# EAGLE design homecomputer-6502 (EAGLE 6.5.0)
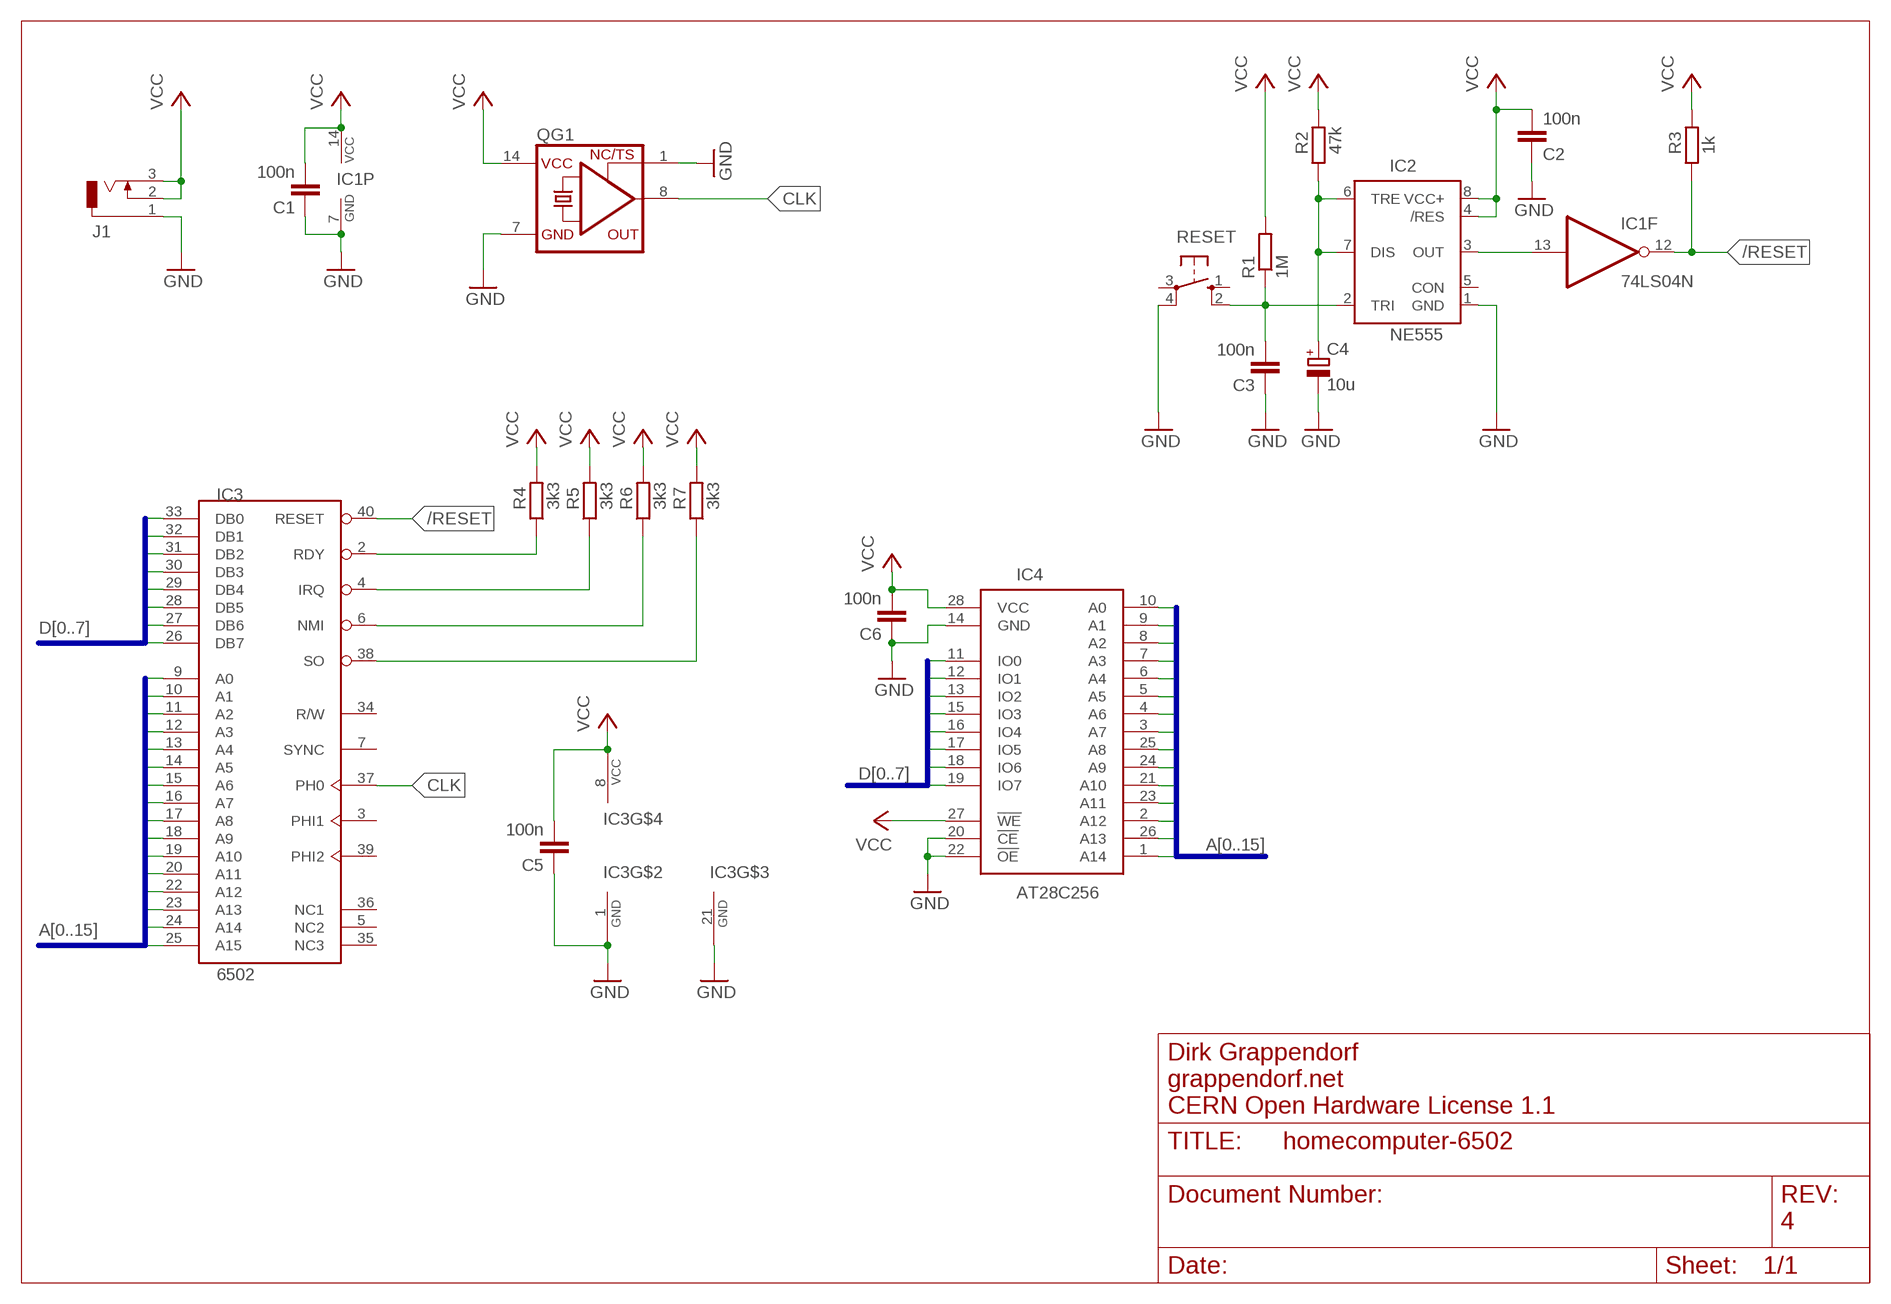
[diagram p0: schematic, sheet 1]

## Parts
C1  100n  C-EU025-024X044  [C025-024X044]
C2  100n  C-EU025-024X044  [C025-024X044]
C3  100n  C-EU025-024X044  [C025-024X044]
C4  10u  CPOL-EUE2,5-6E  [E2,5-6E]
C5  100n  C-EU025-024X044  [C025-024X044]
C6  100n  C-EU025-024X044  [C025-024X044]
IC1  74LS04N  [DIL14]
IC2  NE555  [DIL-08]
IC3  6502  [DIP40]
IC4  AT28C256  [DIL28-6]
J1  DCJ0303  [DCJ0303]
QG1  XO-14  [DIL14S]
R1  1M  R-EU_0204/5  [0204/5]
R2  47k  R-EU_0204/5  [0204/5]
R3  1k  R-EU_0204/5  [0204/5]
R4  3k3  R-EU_0204/5  [0204/5]
R5  3k3  R-EU_0204/5  [0204/5]
R6  3k3  R-EU_0204/5  [0204/5]
R7  3k3  R-EU_0204/5  [0204/5]
RESET  10-XX  [B3F-10XX]

## Nets
/RESET: IC1.12(F:O) IC3.40(RESET) R3.1
A0: IC3.9(A0) IC4.10(A0)
A1: IC3.10(A1) IC4.9(A1)
A2: IC3.11(A2) IC4.8(A2)
A3: IC3.12(A3) IC4.7(A3)
A4: IC3.13(A4) IC4.6(A4)
A5: IC3.14(A5) IC4.5(A5)
A6: IC3.15(A6) IC4.4(A6)
A7: IC3.16(A7) IC4.3(A7)
A8: IC3.17(A8) IC4.25(A8)
A9: IC3.18(A9) IC4.24(A9)
A10: IC3.19(A10) IC4.21(A10)
A11: IC3.20(A11) IC4.23(A11)
A12: IC3.22(A12) IC4.2(A12)
A13: IC3.23(A13) IC4.26(A13)
A14: IC3.24(A14) IC4.1(A14)
A15: IC3.25(A15)
CLK: IC3.37(PH0) QG1.8(OUT)
D0: IC3.33(DB0) IC4.11(IO0)
D1: IC3.32(DB1) IC4.12(IO1)
D2: IC3.31(DB2) IC4.13(IO2)
D3: IC3.30(DB3) IC4.15(IO3)
D4: IC3.29(DB4) IC4.16(IO4)
D5: IC3.28(DB5) IC4.17(IO5)
D6: IC3.27(DB6) IC4.18(IO6)
D7: IC3.26(DB7) IC4.19(IO7)
GND: C1.1 C2.1 C3.1 C4.- C5.1 C6.1 IC1.7(P:GND) IC2.1(GND) IC3.1(GND) IC3.21(GND) IC4.14(GND) IC4.20(!CE) IC4.22(!OE) J1.1 QG1.1(TS) QG1.7(GND) RESET.4(P1)
N$3: IC3.2(RDY) R4.1
N$4: C4.+ IC2.6(TRE) IC2.7(DIS) R2.1
N$5: IC1.13(F:I) IC2.3(OUT)
N$6: C3.2 IC2.2(TRI) R1.1 RESET.2(S1)
N$9: IC3.4(IRQ) R5.1
N$10: IC3.6(NMI) R6.1
N$11: IC3.38(SO) R7.1
VCC: C1.2 C2.2 C5.2 C6.2 IC1.14(P:VCC) IC2.4(/RES) IC2.8(VCC+) IC3.8(VCC) IC4.27(!WE) IC4.28(VCC) J1.2 J1.3 QG1.14(VCC) R1.2 R2.2 R3.2 R4.2 R5.2 R6.2 R7.2
Unconnected: IC1.1(A:I) IC1.2(A:O) IC1.3(B:I) IC1.4(B:O) IC1.5(C:I) IC1.6(C:O) IC1.8(D:O) IC1.9(D:I) IC1.10(E:O) IC1.11(E:I) IC2.5(CON) IC3.3(PHI1) IC3.5(NC2) IC3.7(SYNC) IC3.34(R/W) IC3.35(NC3) IC3.36(NC1) IC3.39(PHI2) RESET.1(S) RESET.3(P)

## Buses
A[0..15]
D[0..7]

## Notes on the sheet
- Dirk Grappendorf
- grappendorf.net
- CERN Open Hardware License 1.1
- 4

## Library data of the parts
C1-C3 C5 C6 = rcl:C-EU: CAPACITOR, European symbol
C4 = rcl:CPOL-EU: POLARIZED CAPACITOR, European symbol
IC1 = 74xx-eu:74*04: Hex INVERTER
IC2 = st-microelectronics:NE555: General purpose bipolar Timer; MF: Arrow Electronics; MPN: NE555N; OC_FARNELL: 1467742; OC_NEWARK: 89K1486
IC3 = 6502:6502: 6502 processor
IC4 = atmel-28c:AT28C256: EEPROM 32Kx8 256k bit The AT28C256 is a high-performance Electrically Erasable and Programmable Read Only Memory. Its 256K of memory is organized as 32,768 words by 8 bits.
J1 = con-jack:DCJ0303: DC POWER JACK Source: DCJ0303.pdf; OC_FARNELL: unknown; OC_NEWARK: unknown
QG1 = crystal2:XO-: CRYSTAL
R1-R7 = rcl:R-EU_: RESISTOR, European symbol
RESET = switch-omron:10-XX: OMRON SWITCH; MPN: B3F-1000; OC_FARNELL: 176432; OC_NEWARK: 36M3542

## Board
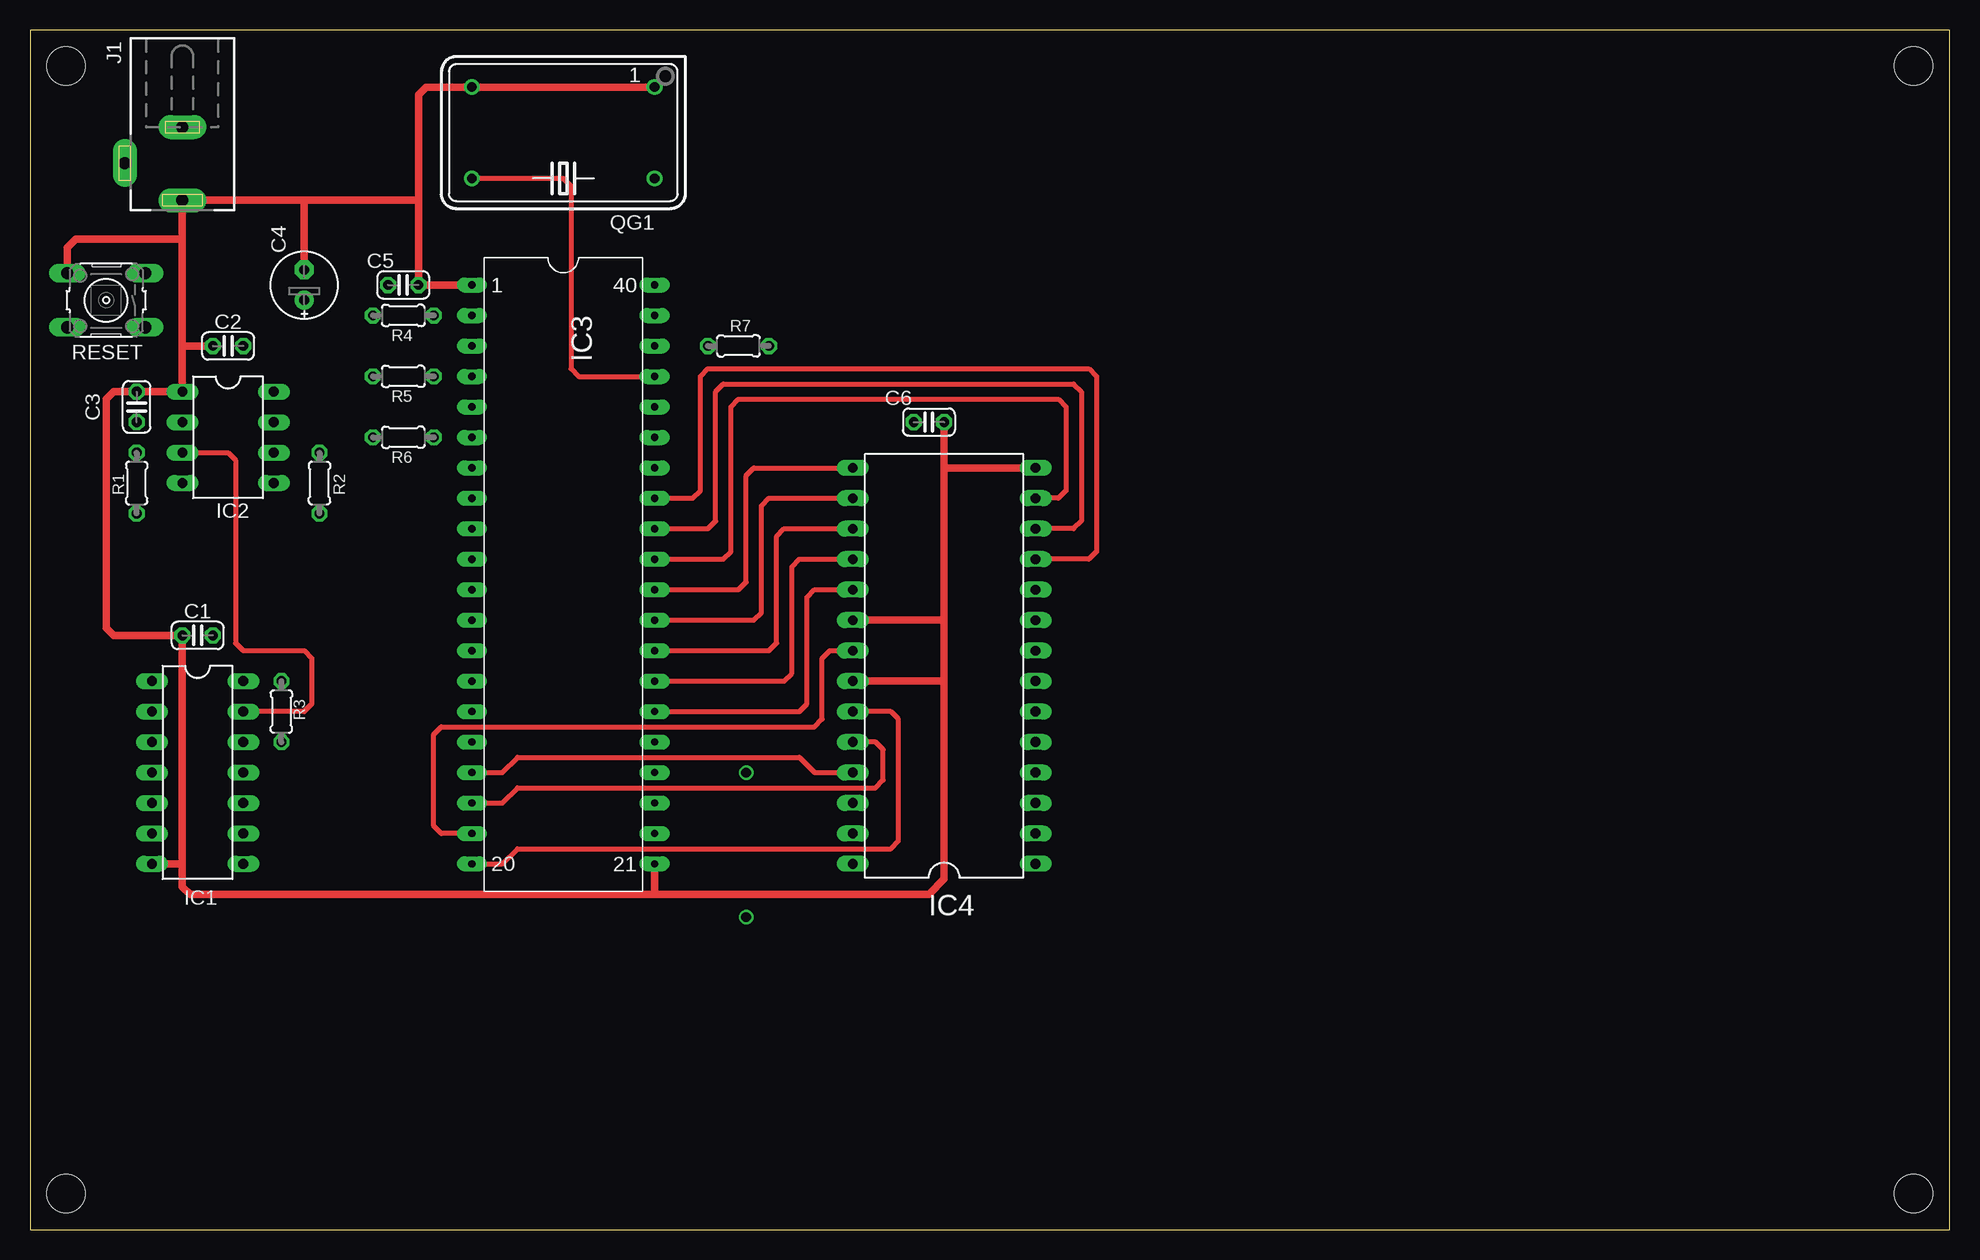
[diagram p1: board, top side]
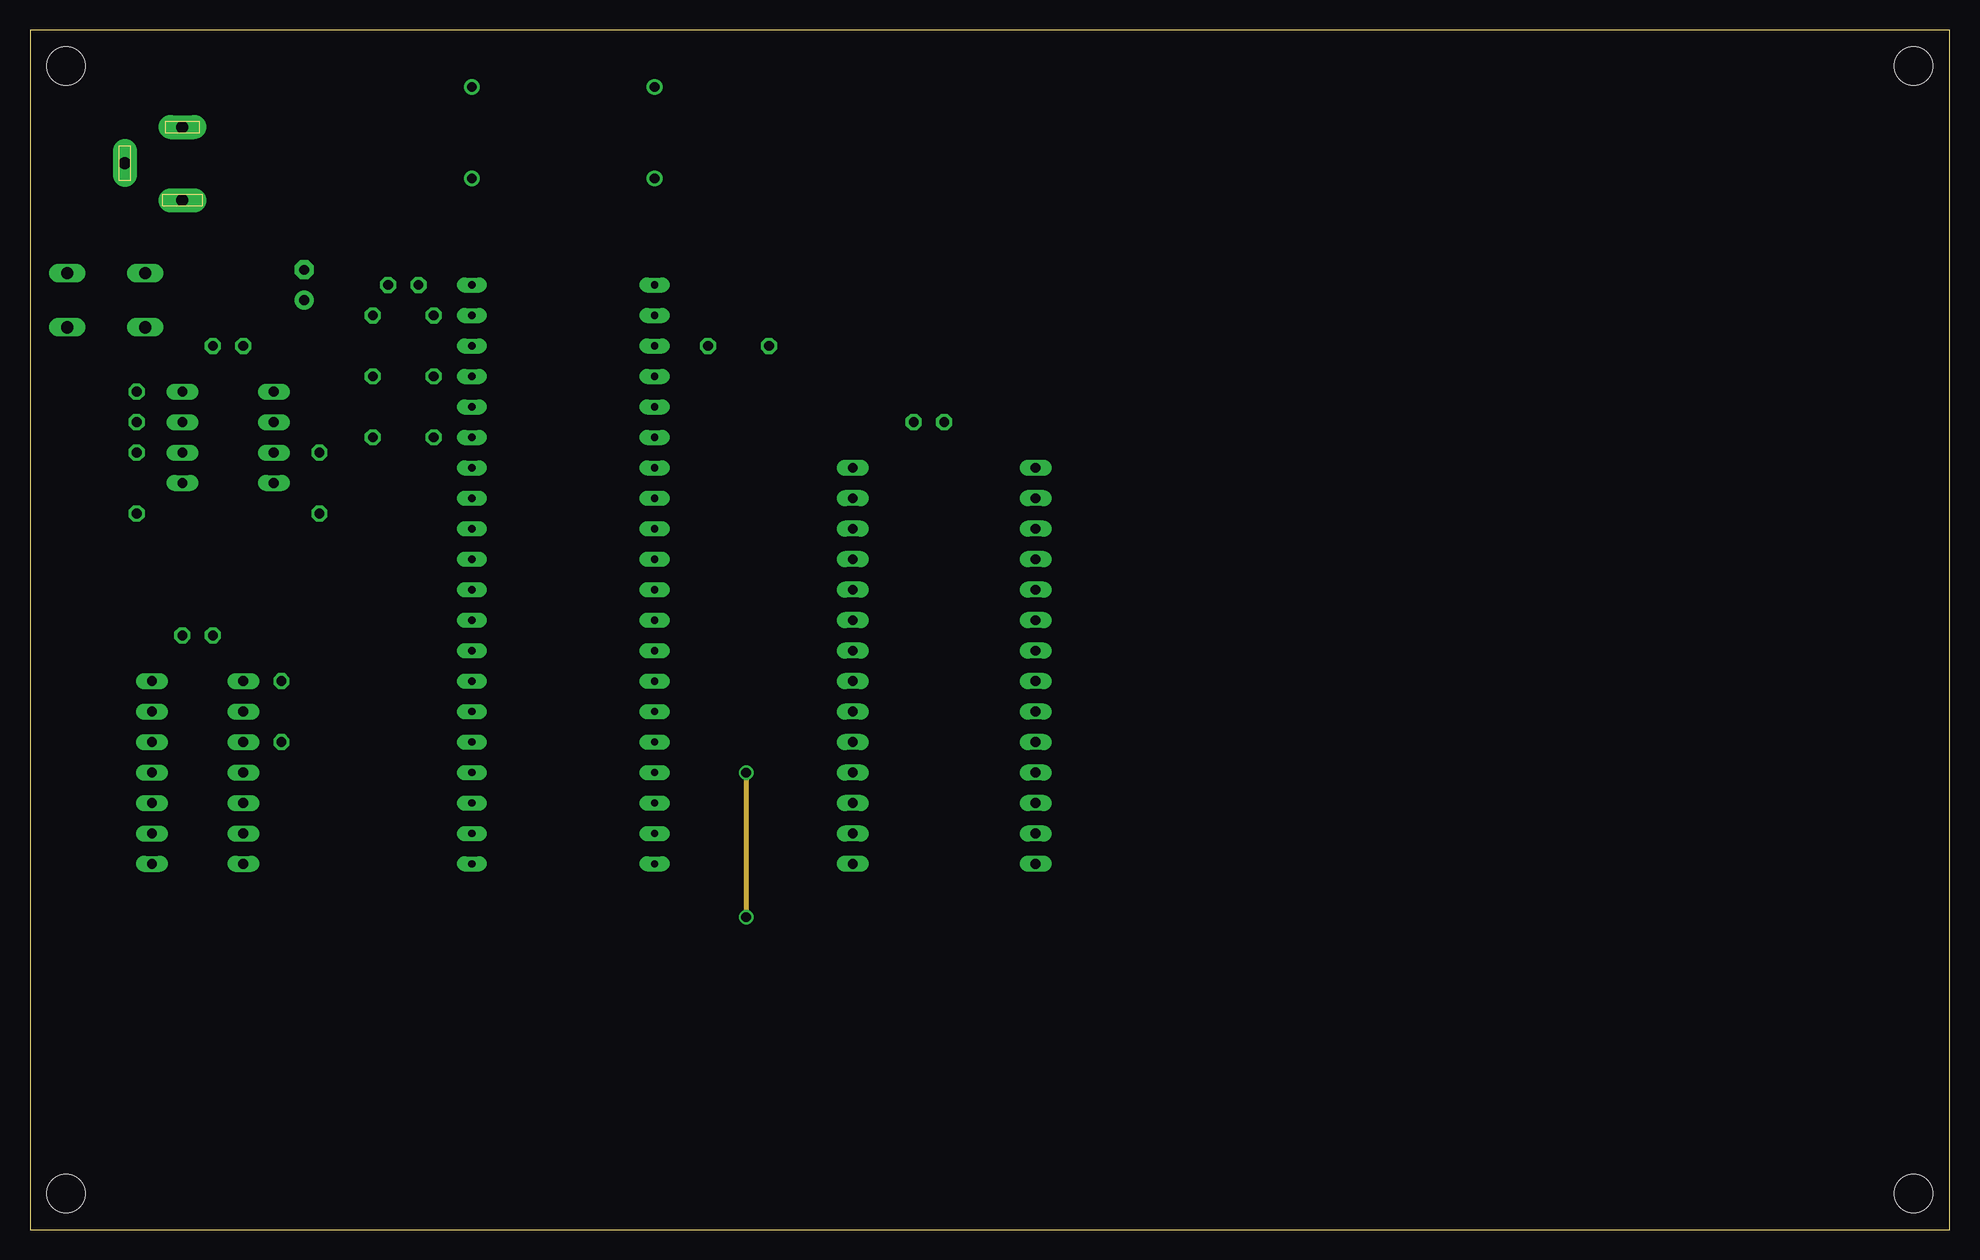
[diagram p2: board, inner layer Route2]
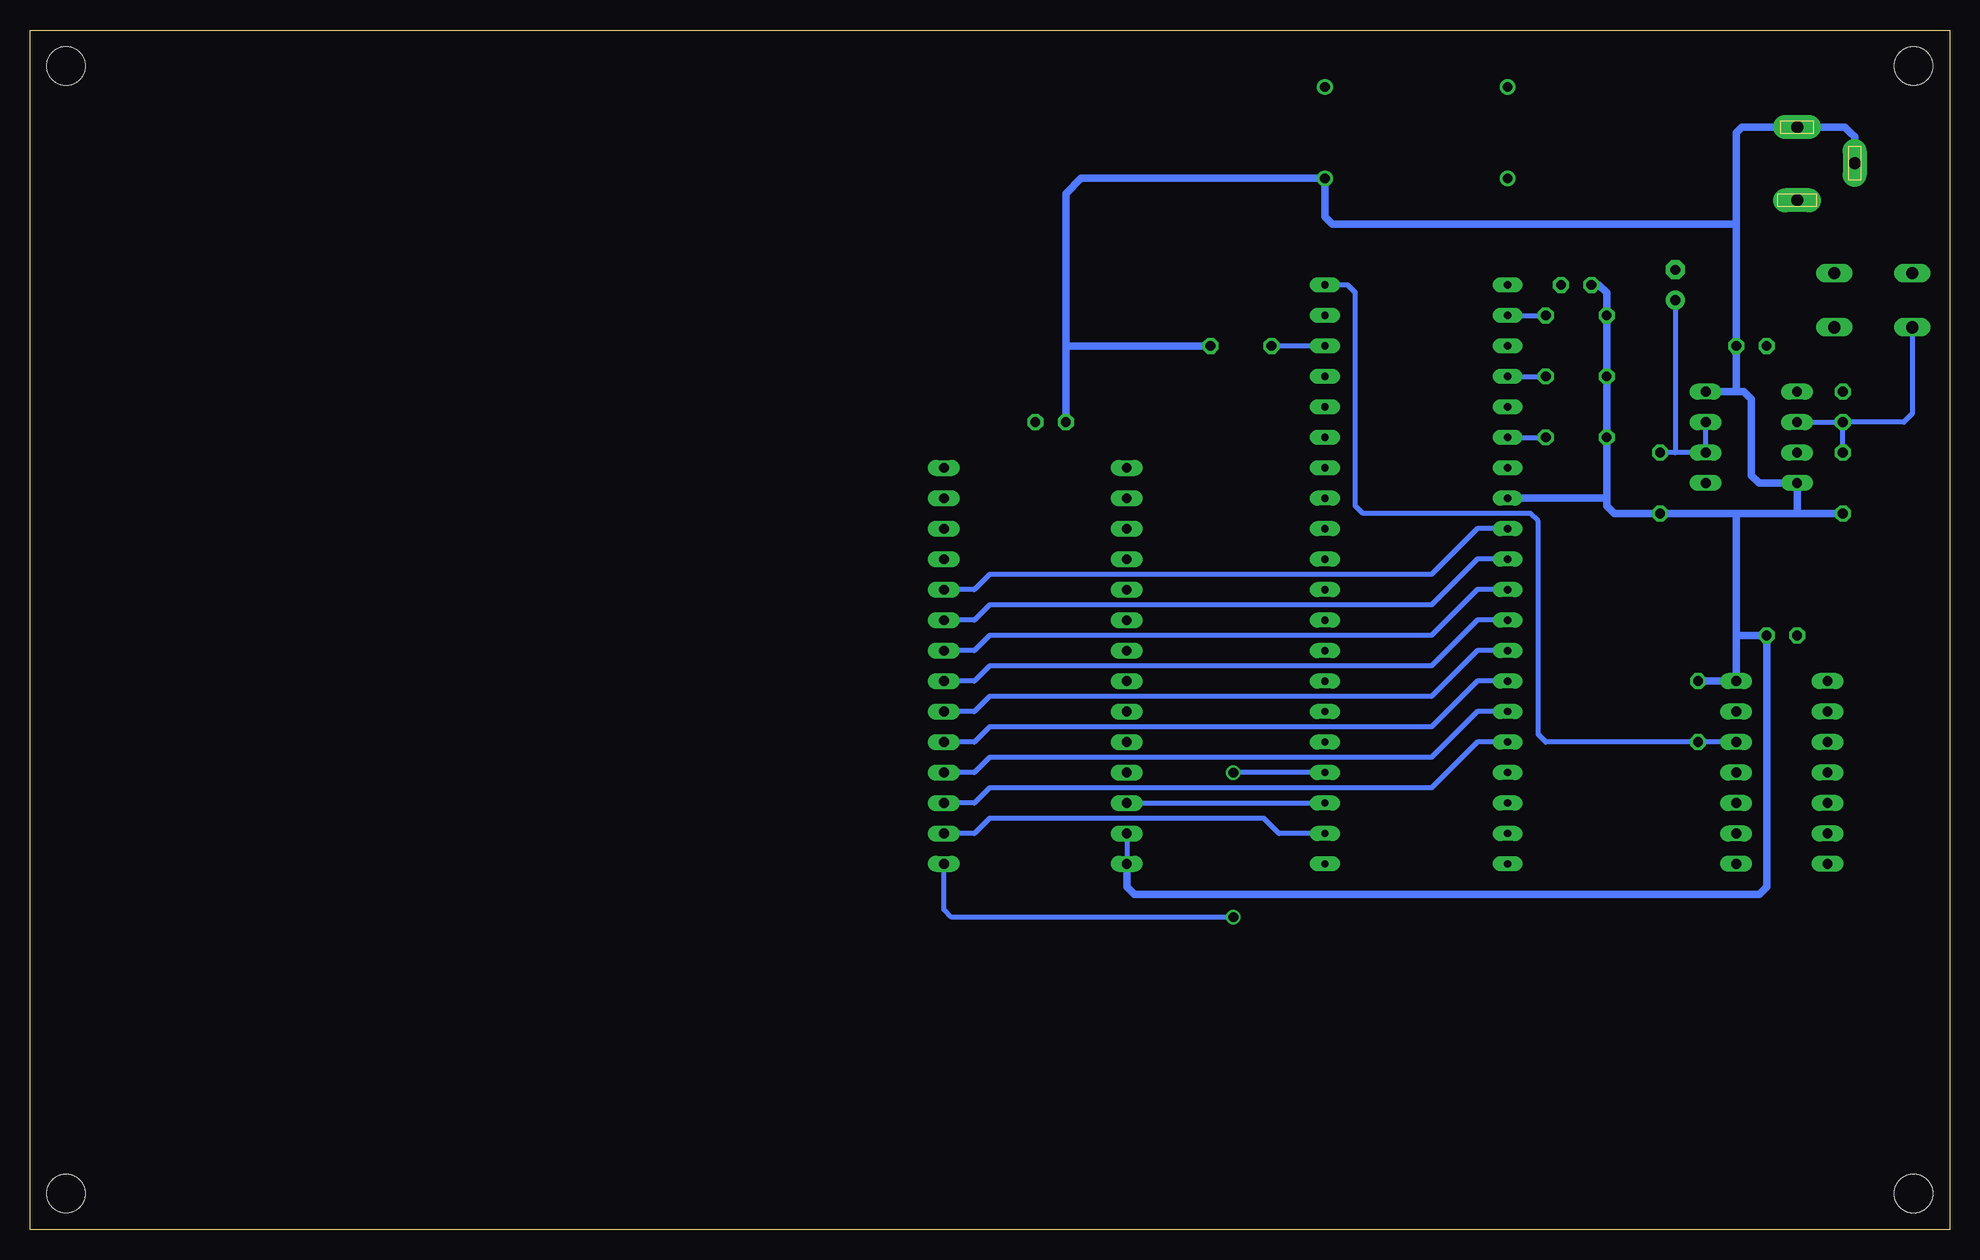
[diagram p3: board, bottom side, seen from below]

Size 160 x 100 mm. Coordinates in mm from the lower left corner, seen from the top.
Outline: 0,0 160,0 160,100 0,100 0,0
Copper layers (1*2*16): Top 0.035mm / dielectric 0.75mm / Route2 0.035mm / dielectric 0.75mm / Bottom 0.035mm
Design rules "default *": minimum track width 10mil, minimum drill 24mil, track to track 8mil, track to pad 8mil, pad to pad 8mil, via to via 8mil, smd to smd 8mil, copper to edge 40mil, drill to drill 8mil, minimum pad ring 10mil, minimum via ring 8mil, stop-mask expansion 4mil, vias tented up to drill 0mil, thermal gap 10mil
Holes 3.2 mm at 3,97 157,97 3,3 157,3

### Footprints (pad centres in the part's own frame; a part is rotated, then mirrored left to right if it is on the bottom)
C025-024X044 = drill 0.813 octagon: 1 -1.27,0; 2 1.27,0
E2,5-6E = drill 0.813 pad 1.575: + -1.27,0 | drill 0.813 pad 1.575 octagon: - 1.27,0
DIL14 = drill 0.813 long: 1 -7.62,-3.81; 2 -5.08,-3.81; 3 -2.54,-3.81; 4 0,-3.81; 5 2.54,-3.81; 6 5.08,-3.81; 7 7.62,-3.81; 8 7.62,3.81; 9 5.08,3.81; 10 2.54,3.81; 11 0,3.81; 12 -2.54,3.81; 13 -5.08,3.81; 14 -7.62,3.81
DIL-08 = drill 0.813 long: 1 -3.81,-3.81; 2 -1.27,-3.81; 3 1.27,-3.81; 4 3.81,-3.81; 5 3.81,3.81; 6 1.27,3.81; 7 -1.27,3.81; 8 -3.81,3.81
DIP40 = drill 0.61 pad 1.27 long: 1 -24.13,-7.62; 2 -21.59,-7.62; 3 -19.05,-7.62; 4 -16.51,-7.62; 5 -13.97,-7.62; 6 -11.43,-7.62; 7 -8.89,-7.62; 8 -6.35,-7.62; 9 -3.81,-7.62; 10 -1.27,-7.62; 11 1.27,-7.62; 12 3.81,-7.62; 13 6.35,-7.62; 14 8.89,-7.62; 15 11.43,-7.62; 16 13.97,-7.62; 17 16.51,-7.62; 18 19.05,-7.62; 19 21.59,-7.62; 20 24.13,-7.62; 21 24.13,7.62; 22 21.59,7.62; 23 19.05,7.62; 24 16.51,7.62; 25 13.97,7.62; 26 11.43,7.62; 27 8.89,7.62; 28 6.35,7.62; 29 3.81,7.62; 30 1.27,7.62; 31 -1.27,7.62; 32 -3.81,7.62; 33 -6.35,7.62; 34 -8.89,7.62; 35 -11.43,7.62; 36 -13.97,7.62; 37 -16.51,7.62; 38 -19.05,7.62; 39 -21.59,7.62; 40 -24.13,7.62
DIL28-6 = drill 0.813 long: 1 -16.51,-7.62; 2 -13.97,-7.62; 3 -11.43,-7.62; 4 -8.89,-7.62; 5 -6.35,-7.62; 6 -3.81,-7.62; 7 -1.27,-7.62; 8 1.27,-7.62; 9 3.81,-7.62; 10 6.35,-7.62; 11 8.89,-7.62; 12 11.43,-7.62; 13 13.97,-7.62; 14 16.51,-7.62; 15 16.51,7.62; 16 13.97,7.62; 17 11.43,7.62; 18 8.89,7.62; 19 6.35,7.62; 20 3.81,7.62; 21 1.27,7.62; 22 -1.27,7.62; 23 -3.81,7.62; 24 -6.35,7.62; 25 -8.89,7.62; 26 -11.43,7.62; 27 -13.97,7.62; 28 -16.51,7.62
DCJ0303 = drill 1 pad 2 long: 1 0,3.1; 2 4.8,0; 3 0,-3
DIL14S = drill 0.813: 1 -7.62,-3.81; 7 7.62,-3.81; 8 7.62,3.81; 14 -7.62,3.81
0204/5 = drill 0.813 octagon: 1 -2.54,0; 2 2.54,0
B3F-10XX = drill 1.016 long: 1 -3.251,2.261; 2 3.251,2.261; 3 -3.251,-2.261; 4 3.251,-2.261

### Placement (x,y rotation side)
C1  13.97,49.53 0 top
C2  16.51,73.66 0 top
C3  8.89,68.58 270 top
C4  22.86,78.74 90 top
C5  31.11,78.74 180 top
C6  74.93,67.31 180 top
IC1  13.97,38.1 270 top
IC2  16.51,66.04 270 top
IC3  44.45,54.61 270 top
IC4  76.2,46.99 90 top
J1  12.7,88.9 180 top
QG1  44.45,91.44 180 top
R1  8.89,62.23 270 top
R2  24.13,62.23 270 top
R3  20.95,43.18 90 top
R4  31.11,76.2 180 top
R5  31.11,71.12 180 top
R6  31.11,66.04 180 top
R7  59.05,73.66 0 top
RESET  6.35,77.47 180 top

### Tracks (layer width: path | path; a pad name or v marks a point on that pad's centre or on a via)
/RESET
  Bottom 0.406: IC1.12 R3.1 33.66,40.64 34.29,41.27 34.29,59.05 34.92,59.69 48.9,59.69 49.53,60.33 49.53,78.11 50.16,78.74 IC3.40
A0
  Bottom 0.406: IC3.9 39.37,58.42 43.18,54.61 80.01,54.61 81.28,53.34 IC4.10
A1
  Bottom 0.406: IC3.10 39.37,55.88 43.18,52.07 80.01,52.07 81.28,50.8 IC4.9
A2
  Bottom 0.406: IC3.11 39.37,53.34 43.18,49.53 80.01,49.53 81.28,48.26 IC4.8
A3
  Bottom 0.406: IC3.12 39.37,50.8 43.18,46.99 80.01,46.99 81.28,45.72 IC4.7
A4
  Bottom 0.406: IC3.13 39.37,48.26 43.18,44.45 80.01,44.45 81.28,43.18 IC4.6
A5
  Bottom 0.406: IC3.14 39.37,45.72 43.18,41.91 80.01,41.91 81.28,40.64 IC4.5
A6
  Bottom 0.406: IC3.15 39.37,43.18 43.18,39.37 80.01,39.37 81.28,38.1 IC4.4
A7
  Bottom 0.406: IC3.16 39.37,40.64 43.18,36.83 80.01,36.83 81.28,35.56 IC4.3
A8
  Top 0.406: IC3.17 39.37,38.1 40.64,39.37 64.14,39.37 65.41,38.1 IC4.25
A9
  Top 0.406: IC3.18 39.37,35.56 40.64,36.83 70.48,36.83 71.12,37.47 71.12,40.01 70.48,40.64 IC4.24
A10
  Top 0.406: IC3.19 34.29,33.02 33.66,33.66 33.66,41.27 34.29,41.91 65.41,41.91 66.04,42.55 66.04,47.62 66.67,48.26 IC4.21
A11
  Top 0.406: IC3.20 39.37,30.48 40.64,31.75 71.75,31.75 72.39,32.38 72.39,42.55 71.75,43.18 IC4.23
A12
  Bottom 0.406: IC3.22 55.88,33.02 57.15,34.29 80.01,34.29 81.28,33.02 IC4.2
A13
  Bottom 0.406: IC4.26 IC3.23
A14  (via drill 0.8)
  Route2 0.406: v59.69,38.1 v59.69,26.04
  Bottom 0.406: IC3.24 v59.69,38.1 | v59.69,26.04 83.19,26.04 83.82,26.67 IC4.1
CLK
  Top 0.406: QG1.8 44.45,87.63 45.09,87 45.09,71.75 45.72,71.12 IC3.37
D0
  Top 0.406: IC3.33 55.24,60.96 55.88,61.59 55.88,71.12 56.52,71.75 88.27,71.75 88.9,71.12 88.9,56.52 88.27,55.88 IC4.11
D1
  Top 0.406: IC3.32 55.88,58.42 56.52,58.42 57.15,59.05 57.15,69.85 57.78,70.48 87,70.48 87.63,69.85 87.63,59.05 87,58.42 IC4.12
D2
  Top 0.406: IC3.31 56.52,55.88 57.78,55.88 58.42,56.52 58.42,68.58 59.05,69.22 85.72,69.22 86.36,68.58 86.36,61.59 85.72,60.96 IC4.13
D3
  Top 0.406: IC3.30 59.05,53.34 59.69,53.98 59.69,62.87 60.33,63.5 IC4.15
D4
  Top 0.406: IC3.29 60.33,50.8 60.96,51.44 60.96,60.33 61.59,60.96 IC4.16
D5
  Top 0.406: IC3.28 61.59,48.26 62.23,48.9 62.23,57.78 62.87,58.42 IC4.17
D6
  Top 0.406: IC3.27 62.87,45.72 63.5,46.35 63.5,55.24 64.14,55.88 IC4.18
D7
  Top 0.406: IC3.26 64.14,43.18 64.77,43.81 64.77,52.7 65.41,53.34 IC4.19
GND
  Top 0.61: IC3.1 C5.1 32.38,85.72 | 12.7,82.55 J1.1 22.86,85.8 | 12.7,82.55 12.7,73.66 | 12.7,73.66 IC2.1 C3.1 6.99,69.85 6.35,69.22 6.35,50.16 6.99,49.53 C1.1 12.7,30.48 | C2.1 12.7,73.66 | RESET.4 3.1,81.84 3.81,82.55 12.7,82.55 | 52.07,27.94 74.93,27.94 76.2,29.21 76.2,45.72 | 76.2,45.72 76.2,50.8 | 76.2,50.8 76.2,63.5 | 76.2,63.5 C6.1 | IC4.14 76.2,63.5 | IC3.21 52.07,27.94 | IC4.22 76.2,45.72 | IC4.20 76.2,50.8 | QG1.1 QG1.7 33.02,95.25 32.38,94.61 32.38,85.72 | 22.86,85.8 32.31,85.8 32.38,85.72 | C4.- 22.86,85.8 | 12.7,30.48 12.7,28.57 13.34,27.94 52.07,27.94 | IC1.7 12.7,30.48
N$3
  Bottom 0.406: IC3.2 R4.1
N$4
  Bottom 0.406: 22.86,64.77 IC2.6 IC2.7 | 22.86,64.77 R2.1 | C4.+ 22.86,64.77
N$5
  Top 0.406: IC2.3 16.51,64.77 17.14,64.14 17.14,48.9 17.78,48.26 22.86,48.26 23.5,47.62 23.5,43.81 22.86,43.18 IC1.13
N$6
  Bottom 0.406: IC2.2 C3.2 | R1.1 C3.2 | RESET.2 3.1,68.02 3.81,67.31 C3.2
N$9
  Bottom 0.406: IC3.4 R5.1
N$10
  Bottom 0.406: IC3.6 R6.1
N$11
  Bottom 0.406: IC3.38 R7.1
VCC
  Bottom 0.406: IC4.27 IC4.28
  Bottom 0.61: J1.2 7.9,91.08 8.26,91.44 8.71,91.9 J1.3 17.32,91.9 17.78,91.44 17.78,83.82 | R1.2 12.7,59.69 | 12.7,59.69 17.78,59.69 | 17.78,59.69 R2.2 27.94,59.69 28.57,60.33 28.57,60.96 | 12.7,59.69 IC2.4 15.88,62.23 16.51,62.87 16.51,69.22 17.14,69.85 17.78,69.85 | 17.78,69.85 IC2.8 | 17.78,69.85 C2.2 17.78,83.82 | 28.57,60.96 R6.2 R5.2 R4.2 28.57,78.11 29.21,78.74 C5.2 | IC3.8 28.57,60.96 | 73.66,73.66 73.66,86.36 72.39,87.63 QG1.14 52.07,84.45 51.44,83.82 17.78,83.82 | 73.66,73.66 C6.2 | R7.2 73.66,73.66 | 17.78,49.53 IC1.14 R3.2 | 17.78,49.53 17.78,59.69 | 17.78,49.53 C1.2 15.24,28.57 15.88,27.94 67.94,27.94 68.58,28.57 IC4.28